# EAGLE design 9xVoice MikeB TH v101 (EAGLE 6.3)
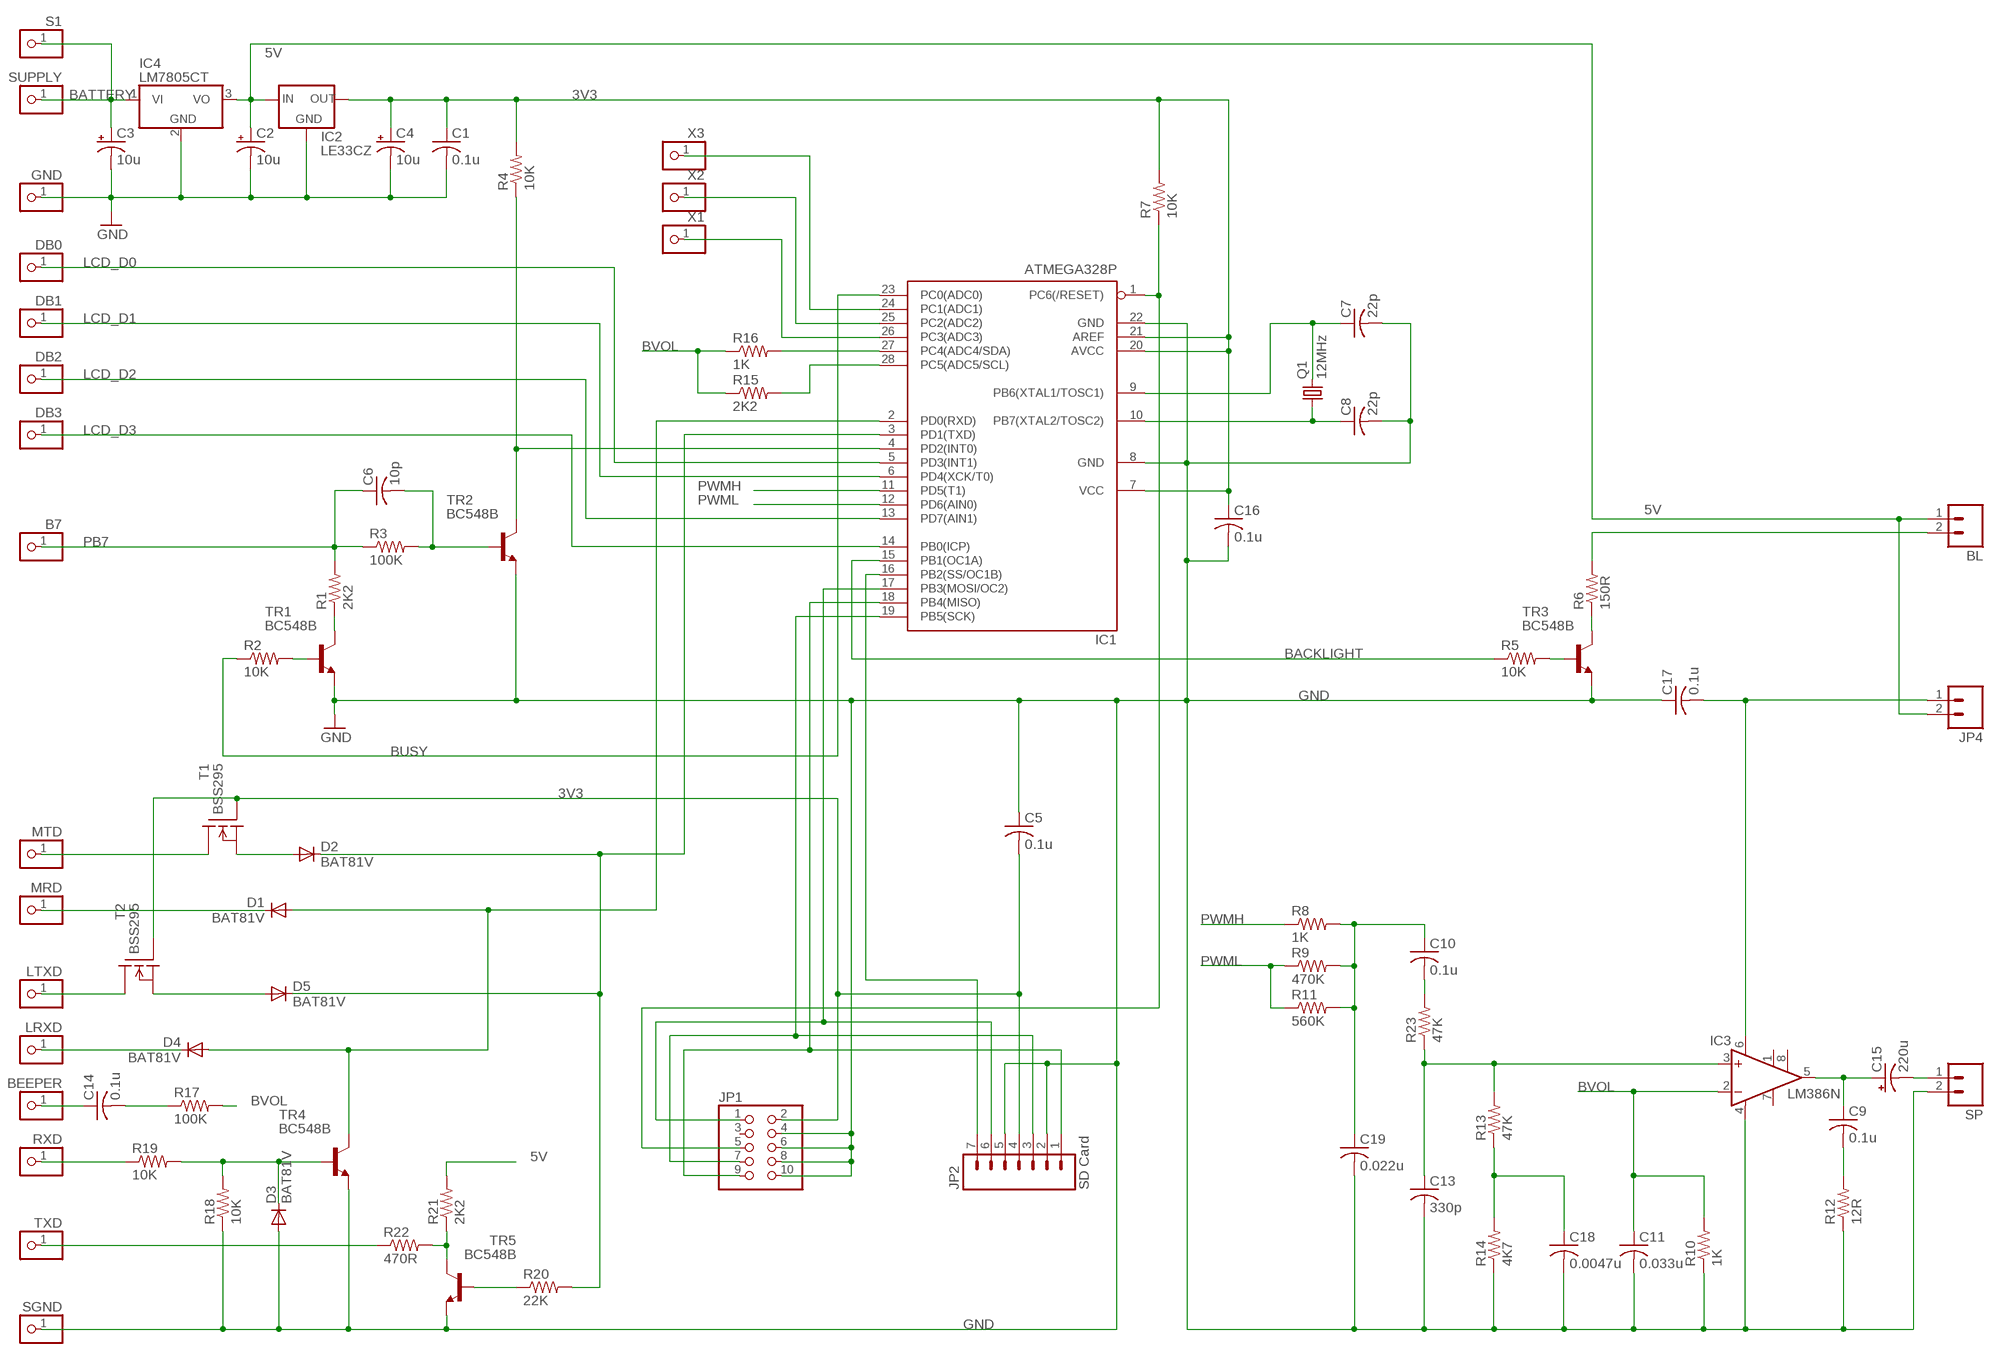
[diagram p0: schematic, sheet 1]

## Parts
B7  PINHD-1X1  [1X01]
BEEPER  PINHD-1X1  [1X01]
BL  M02PTH  [1X02]
C1  0.1u  C-US025-024X044  [C025-024X044]
C2  10u  CPOL-USE1.8-4  [E1,8-4]
C3  10u  CPOL-USE1.8-4  [E1,8-4]
C4  10u  CPOL-USE1.8-4  [E1,8-4]
C5  0.1u  C-US025-024X044  [C025-024X044]
C6  10p  C-US025-024X044  [C025-024X044]
C7  22p  C-US025-024X044  [C025-024X044]
C8  22p  C-US025-024X044  [C025-024X044]
C9  0.1u  C-US025-024X044  [C025-024X044]
C10  0.1u  C-US025-024X044  [C025-024X044]
C11  0.033u  C-US025-024X044  [C025-024X044]
C13  330p  C-US025-024X044  [C025-024X044]
C14  0.1u  C-US025-024X044  [C025-024X044]
C15  220u  CPOL-USE2.5-6  [E2,5-6]
C16  0.1u  C-US025-024X044  [C025-024X044]
C17  0.1u  C-US025-024X044  [C025-024X044]
C18  0.0047u  C-US025-024X044  [C025-024X044]
C19  0.022u  C-US025-024X044  [C025-024X044]
D1  BAT81V  DIODE-D-2.5  [D-2.5]
D2  BAT81V  DIODE-D-2.5  [D-2.5]
D3  BAT81V  DIODE-D-2.5  [D-2.5]
D4  BAT81V  DIODE-D-2.5  [D-2.5]
D5  BAT81V  DIODE-D-2.5  [D-2.5]
DB0  PINHD-1X1  [1X01]
DB1  PINHD-1X1  [1X01]
DB2  PINHD-1X1  [1X01]
DB3  PINHD-1X1  [1X01]
GND  PINHD-1X1  [1X01]
IC1  ATMEGA328P  MEGA8-P  [DIL28-3]
IC2  LE33CZ  78LXX  [78LXX]
IC3  LM386N  LM386N-1  [DIL08]
IC4  LM7805CT  7805T  [TO220H]
JP1  PINHD-2X5  [2X05]
JP2  SD Card  M07  [1X07]
JP4  M02PTH  [1X02]
LRXD  PINHD-1X1  [1X01]
LTXD  PINHD-1X1  [1X01]
MRD  PINHD-1X1  [1X01]
MTD  PINHD-1X1  [1X01]
Q1  12MHz  CRYSTALHC49US  [HC49US]
R1  2K2  R-US_0207/2V  [0207/2V]
R2  10K  R-US_0207/10  [0207/10]
R3  100K  R-US_0207/2V  [0207/2V]
R4  10K  R-US_0207/2V  [0207/2V]
R5  10K  R-US_0207/2V  [0207/2V]
R6  150R  R-US_0207/2V  [0207/2V]
R7  10K  R-US_0207/2V  [0207/2V]
R8  1K  R-US_0207/2V  [0207/2V]
R9  470K  R-US_0207/2V  [0207/2V]
R10  1K  R-US_0207/2V  [0207/2V]
R11  560K  R-US_0207/2V  [0207/2V]
R12  12R  R-US_0207/2V  [0207/2V]
R13  47K  R-US_0207/2V  [0207/2V]
R14  4K7  R-US_0207/2V  [0207/2V]
R15  2K2  R-US_0207/2V  [0207/2V]
R16  1K  R-US_0207/2V  [0207/2V]
R17  100K  R-US_0207/2V  [0207/2V]
R18  10K  R-US_0207/2V  [0207/2V]
R19  10K  R-US_0207/2V  [0207/2V]
R20  22K  R-US_0207/2V  [0207/2V]
R21  2K2  R-US_0207/2V  [0207/2V]
R22  470R  R-US_0207/2V  [0207/2V]
R23  47K  R-US_0207/2V  [0207/2V]
RXD  PINHD-1X1  [1X01]
S1  PINHD-1X1  [1X01]
SGND  PINHD-1X1  [1X01]
SP  M02PTH  [1X02]
SUPPLY  PINHD-1X1  [1X01]
T1  BSS295  [TO92]
T2  BSS295  [TO92]
TR1  BC548B  [TO92-EBC]
TR2  BC548B  [TO92-EBC]
TR3  BC548B  [TO92-EBC]
TR4  BC548B  [TO92-EBC]
TR5  BC548B  [TO92-EBC]
TXD  PINHD-1X1  [1X01]
X1  PINHD-1X1  [1X01]
X2  PINHD-1X1  [1X01]
X3  PINHD-1X1  [1X01]

## Nets
3V3: C1.1 C4.+ C5.2 C16.1 IC1.7(VCC) IC1.20(AVCC) IC1.21(AREF) IC2.OUT JP1.2 JP2.4 R4.2 R7.2 T1.1(G) T2.1(G)
5V: BL.1 C2.+ IC2.IN IC4.3(VO) JP4.2 R21.2
BACKLIGHT: IC1.15(PB1(OC1A)) R5.1
BATTERY: C3.+ IC4.1(VI) S1.1 SUPPLY.1
BUSY: IC1.23(PC0(ADC0)) R2.1
BVOL: C11.1 IC3.2(-IN) R10.2 R15.1 R16.1 R17.2
GND: C1.2 C2.- C3.- C4.- C5.1 C7.2 C8.2 C11.2 C13.2 C16.2 C17.1 C18.2 C19.2 D3.A GND.1 IC1.8(GND) IC1.22(GND) IC2.GND IC3.4(GND) IC4.2(GND) JP1.4 JP1.6 JP1.8 JP1.10 JP2.2 JP2.5 R10.1 R12.1 R14.1 R18.1 SGND.1 SP.2 TR1.E TR2.E TR3.E TR4.E TR5.E
LCD_D0: DB0.1 IC1.5(PD3(INT1))
LCD_D1: DB1.1 IC1.6(PD4(XCK/T0))
LCD_D2: DB2.1 IC1.13(PD7(AIN1))
LCD_D3: DB3.1 IC1.14(PB0(ICP))
MISO: IC1.18(PB4(MISO)) JP1.9 JP2.1
MOSI: IC1.17(PB3(MOSI/OC2)) JP1.1 JP2.6
N$2: R21.1 R22.2 TR5.C
N$3: R22.1 TXD.1
N$4: R20.1 TR5.B
N$5: IC1.28(PC5(ADC5/SCL)) R15.2
N$6: IC1.27(PC4(ADC4/SDA)) R16.2
N$7: IC1.26(PC3(ADC3)) X1.1
N$8: IC1.25(PC2(ADC2)) X2.1
N$9: IC1.24(PC1(ADC1)) X3.1
N$10: R19.1 RXD.1
N$11: D3.C R18.2 R19.2 TR4.B
N$12: D4.C LRXD.1
N$14: D5.A T2.3(S)
N$15: D2.A T1.3(S)
N$16: MTD.1 T1.2(D)
N$17: LTXD.1 T2.2(D)
N$18: D1.C MRD.1
N$21: R1.1 TR1.C
N$22: R2.2 TR1.B
N$23: C6.2 R3.2 TR2.B
N$24: BEEPER.1 C14.1
N$25: C14.2 R17.1
N$26: R5.2 TR3.B
N$27: R6.1 TR3.C
N$28: C10.2 R23.2
N$29: IC1.4(PD2(INT0)) R4.1 TR2.C
N$30: C8.1 IC1.10(PB7(XTAL2/TOSC2)) Q1.1
N$31: C7.1 IC1.9(PB6(XTAL1/TOSC1)) Q1.2
N$33: BL.2 R6.2
N$34: C9.1 C15.+ IC3.5(OUT)
N$35: C9.2 R12.2
N$36: C15.- SP.1
N$37: C17.2 IC3.6(VS) JP4.1
N$38: C13.1 IC3.3(+IN) R13.2 R23.1
N$39: C10.1 C19.1 R8.2 R9.2 R11.2
N$40: C18.1 R13.1 R14.2
PB7: B7.1 C6.1 R1.2 R3.1
PWMH: IC1.11(PD5(T1)) R8.1
PWML: IC1.12(PD6(AIN0)) R9.1 R11.1
RESET: IC1.1(PC6(/RESET)) JP1.5 R7.1
RXD: D1.A D4.A IC1.2(PD0(RXD)) TR4.C
SCK: IC1.19(PB5(SCK)) JP1.7 JP2.3
SS: IC1.16(PB2(SS/OC1B)) JP2.7
TXD: D2.C D5.C IC1.3(PD1(TXD)) R20.2
Unconnected: IC3.1(GAIN) IC3.7(BYPASS) IC3.8(GAIN) JP1.3

## Library data of the parts
B7 BEEPER DB0 DB1-DB3 GND LRXD LTXD MRD MTD RXD S1 SGND SUPPLY TXD X1-X3 = pinhead:PINHD-1X1: PIN HEADER
BL JP4 SP = SparkFun-Connectors:M02: Header 2 Standard 2-pin 0.1" header. Use with straight break away headers (SKU : PRT-00116), right angle break away headers (PRT-00553), swiss pins (PRT-00743), machine pins (PRT-00117), and female headers (PRT-00115). Molex polarized connector foot print use with SKU : PRT-08233 with associated crimp pins and housings.
C1 C5-C11 C13 C14 C16-C19 = rcl:C-US: CAPACITOR, American symbol
C2-C4 C15 = rcl:CPOL-US: POLARIZED CAPACITOR, American symbol
D1-D5 = diode:DIODE-: DIODE
IC1 = atmel:MEGA8-P: MICROCONTROLLER 8 Kbytes FLASH, 1 kbytes SRAM, 512 bytes EEPROM, USART, 4-channel 10 bit ADC, 2-channel 8 bit ADC Pin compatible with Atmega48, ATMega88, ATMega168 Source: avr.lbr; OC_FARNELL: unknown; OC_NEWARK: unknown
IC2 = v-reg:78LXX: VOLTAGE REGULATOR
IC3 = linear:LM386?-*: Low Voltage Audio Power Amplifier Source: http://cache.national.com/ds/LM/LM386.pdf
IC4 = linear:78*: Positive VOLTAGE REGULATOR Source: http://cache.national.com/ds/LM/LM78L05.pdf http://www.fairchildsemi.com/ds/LM/LM7805.pdf
JP1 = pinhead:PINHD-2X5: PIN HEADER
JP2 = SparkFun-Connectors:M07: Header 7 Standard 7-pin 0.1" header. Use with straight break away headers (SKU : PRT-00116), right angle break away headers (PRT-00553), swiss pins (PRT-00743), machine pins (PRT-00117), and female headers (PRT-00115). NOTES ON THE VARIANTS LOCK and LOCK_LONGPADS... This footprint was designed to help hold the alignment of a through-hole component (i.e. 7-pin header) while soldering it into place. You may notice that each hole has been shifted either up or down by 0.005 of an inch from it's more standard position (which is usually a perfectly straight line). This slight alteration caused the pins (the squares in the middle) to touch the edges of the holes. Because they are alternating, it causes a "brace" to hold the header in place. 0.005 has proven to be the perfect amount of "off-center" position when using our standard breakaway headers. Although looks a little odd when you look at the bare footprint, once you have a header in there, the alteration is very hard to notice. Also, if you push a header all the way into place, it is covered up entirely on the bottom side. This idea of altering the position of holes to aid alignment will be further integrated into the Sparkfun Library for other footprints. It can help hold any component with 3 or more connection pins.
Q1 = SparkFun-FreqCtrl:CRYSTAL: Various standard crystals. Proven footprints. Spark Fun Electronics SKU : COM-00534
R1-R23 = rcl:R-US_: RESISTOR, American symbol
T1 T2 = transistor-fet:BSS295: N-Channel Enhancement MOSFET not checked
TR1-TR5 = transistor-npn:BC548*: NPN Transistor

## Board
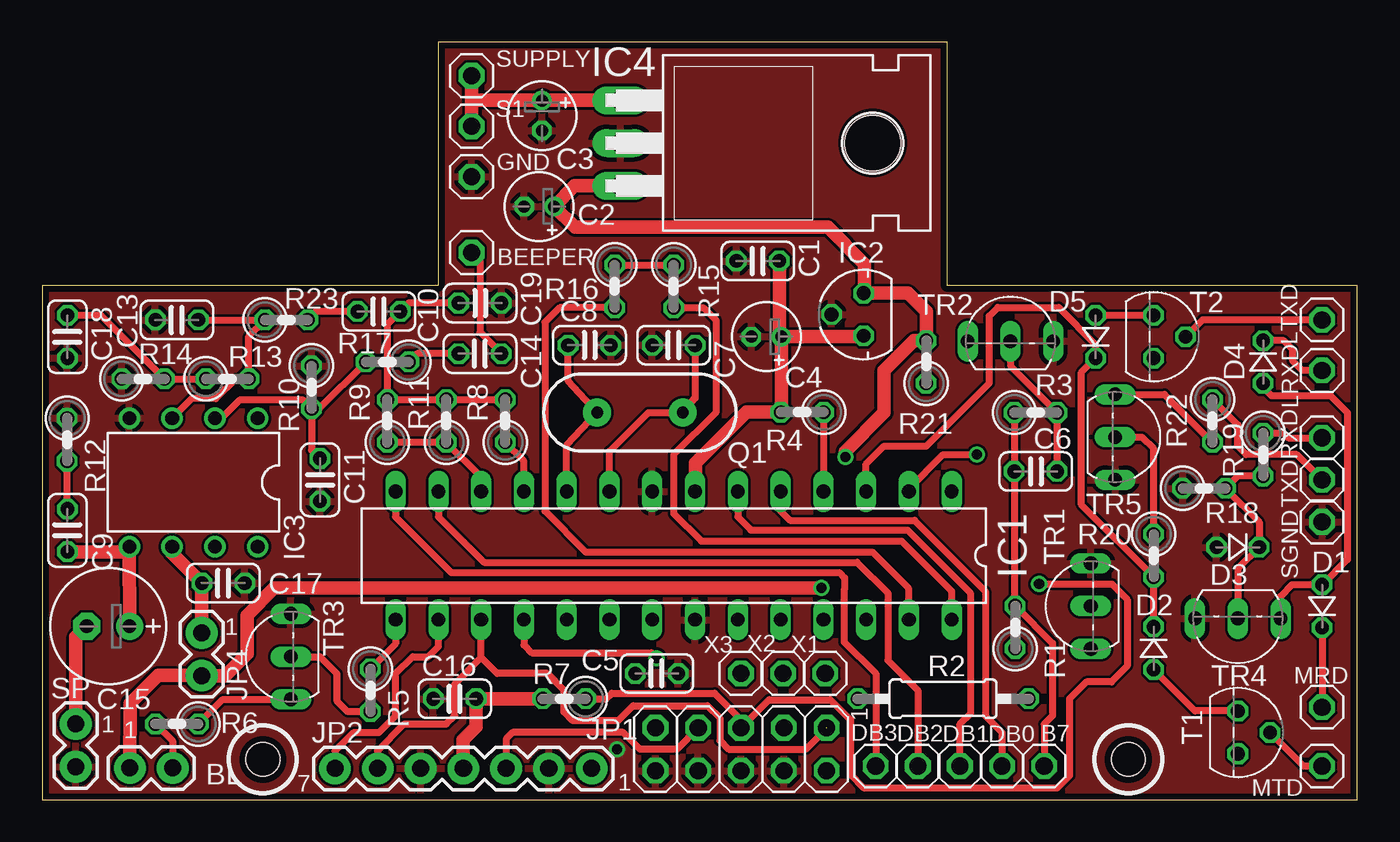
[diagram p1: board, top side]
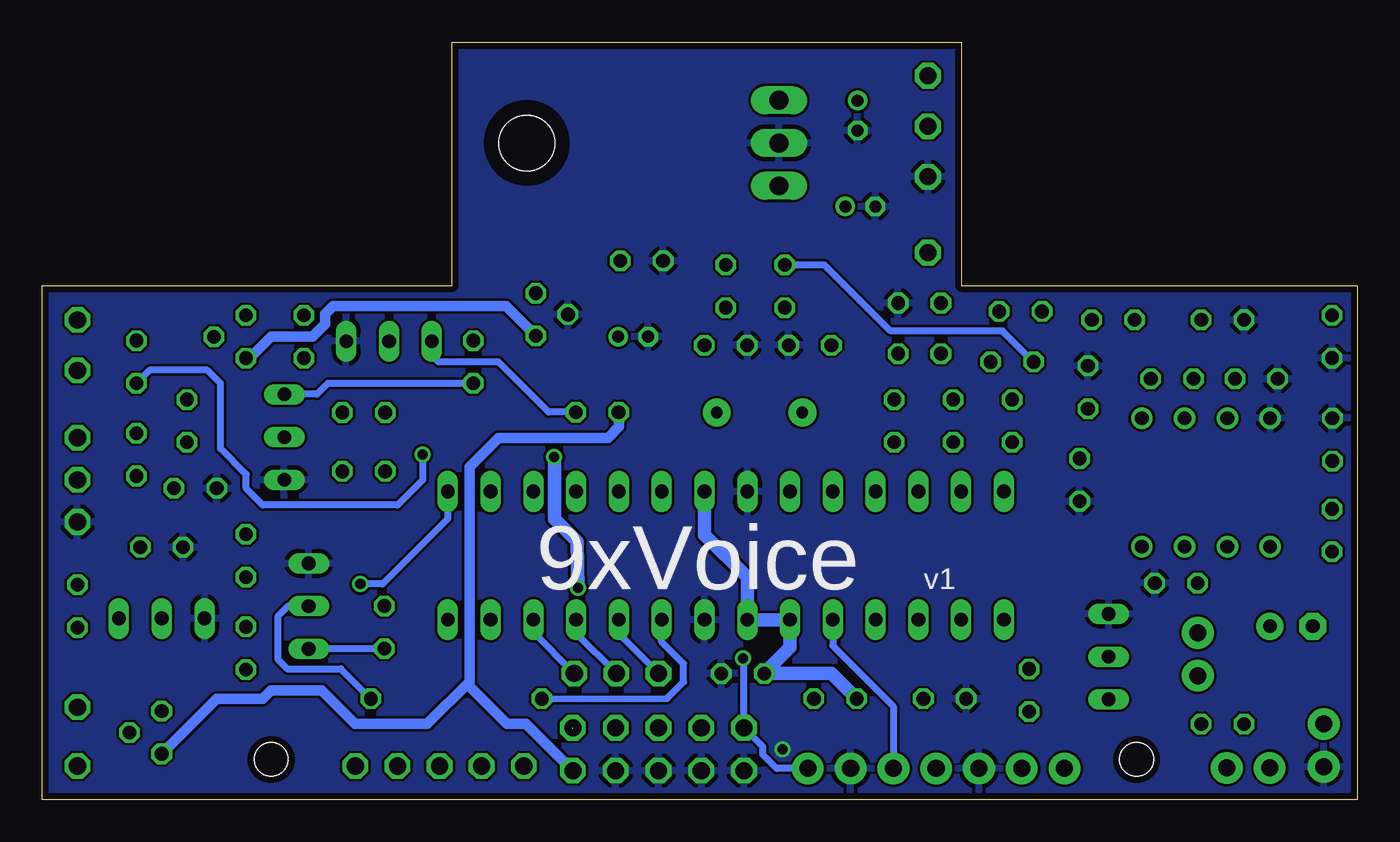
[diagram p2: board, bottom side, seen from below]

Size 78.1 x 45 mm. Coordinates in mm from the lower left corner, seen from the top.
Outline: 0,0 78.1,0 78.1,30.55 53.75,30.55 53.75,45 23.5,45 23.5,30.55 0,30.55 0,0
Copper layers (1*16): Top 0.0356mm / dielectric 1.5011mm / Bottom 0.0356mm
Design rules "LaenPCBOrder *": minimum track width 6mil, minimum drill 13mil, track to track 6mil, track to pad 6mil, pad to pad 6mil, via to via 6mil, smd to smd 6mil, copper to edge 15mil, drill to drill 6mil, minimum pad ring 7mil, minimum via ring 7mil, stop-mask expansion 4mil, vias tented up to drill 24mil, thermal gap 10mil
Holes 2 mm at 13.1,2.4 64.5,2.4

### Footprints (pad centres in the part's own frame; a part is rotated, then mirrored left to right if it is on the bottom)
1X01 = drill 1.016 octagon: 1 0,0
1X02 = drill 1.016 pad 1.88: 1 0,0; 2 2.54,0
C025-024X044 = drill 0.813 octagon: 1 -1.27,0; 2 1.27,0
E1,8-4 = drill 0.711 pad 1.168: + -0.889,0 | drill 0.711 pad 1.168 octagon: - 0.889,0
E2,5-7 = drill 0.813 pad 1.6: + -1.27,0 | drill 0.813 pad 1.6 octagon: - 1.27,0
D-2.5 = drill 0.813 octagon: A 1.27,0; C -1.27,0
DIL28-3 = drill 0.813 long: 1 -16.51,-3.81; 2 -13.97,-3.81; 3 -11.43,-3.81; 4 -8.89,-3.81; 5 -6.35,-3.81; 6 -3.81,-3.81; 7 -1.27,-3.81; 8 1.27,-3.81; 9 3.81,-3.81; 10 6.35,-3.81; 11 8.89,-3.81; 12 11.43,-3.81; 13 13.97,-3.81; 14 16.51,-3.81; 15 16.51,3.81; 16 13.97,3.81; 17 11.43,3.81; 18 8.89,3.81; 19 6.35,3.81; 20 3.81,3.81; 21 1.27,3.81; 22 -1.27,3.81; 23 -3.81,3.81; 24 -6.35,3.81; 25 -8.89,3.81; 26 -11.43,3.81; 27 -13.97,3.81; 28 -16.51,3.81
78LXX = drill 0.813 octagon: GND 0,1.905; IN 1.27,0; OUT -1.27,0
DIL08 = drill 0.813 pad 1.27: 1 -3.81,-3.81; 2 -1.27,-3.81; 3 1.27,-3.81; 4 3.81,-3.81; 5 3.81,3.81; 6 1.27,3.81; 7 -1.27,3.81; 8 -3.81,3.81
TO220H = drill 1.118 long: 1 -2.54,-10.16; 2 0,-10.16; 3 2.54,-10.16 | hole 3.302: 0,4.826
2X05 = drill 1.016 octagon: 1 -5.08,-1.27; 2 -5.08,1.27; 3 -2.54,-1.27; 4 -2.54,1.27; 5 0,-1.27; 6 0,1.27; 7 2.54,-1.27; 8 2.54,1.27; 9 5.08,-1.27; 10 5.08,1.27
1X07 = drill 1.016 pad 1.88: 1 0,0; 2 2.54,0; 3 5.08,0; 4 7.62,0; 5 10.16,0; 6 12.7,0; 7 15.24,0
HC49US = drill 0.7 pad 1.651: 1 -2.54,0; 2 2.54,0
0207/2V = drill 0.813 octagon: 1 -1.27,0; 2 1.27,0
0207/10 = drill 0.813 octagon: 1 -5.08,0; 2 5.08,0
TO92 = drill 0.813 octagon: 1 1.27,0; 2 0,1.905; 3 -1.27,0
TO92-EBC = drill 0.813 long: B 0,-1.27; C -2.54,-1.27; E 2.54,-1.27

### Placement (x,y rotation side)
B7  59.5,2 0 top
BEEPER  25.5,32.5 0 top
BL  5.21,1.89 0 top
C1  42.5,32 180 top
C2  29.52,35.24 180 top
C3  29.68,40.64 270 top
C4  43,27.5 180 top
C5  36.5,7.5 180 top
C6  59,19.5 0 top
C7  37.5,27 180 top
C8  32.5,27 0 top
C9  1.5,16 90 top
C10  20,29 180 top
C11  16.5,19 270 top
C13  8,28.5 180 top
C14  26,26.5 180 top
C15  220u  [E2,5-7]  3.92,10.31 180 top
C16  24.5,6 180 top
C17  10.76,12.87 180 top
C18  1.5,27.5 270 top
C19  26,29.5 0 top
D1  76,11.5 90 top
D2  66,9 270 top
D3  71,15 180 top
D4  72.5,26 270 top
D5  62.55,27.5 90 top
DB0  57,2 0 top
DB1  54.5,2 0 top
DB2  52,2 0 top
DB3  49.5,2 0 top
GND  25.5,37 0 top
IC1  37.5,14.5 180 top
IC2  48.78,28.82 90 top
IC3  8.99,18.85 180 top
IC4  44.5,39 270 top
JP1  41.5,3 180 top
JP2  32.63,1.86 180 top
JP4  9.48,9.91 270 top
LRXD  76,25.5 0 top
LTXD  76,28.5 0 top
MRD  76,5.5 0 top
MTD  76,2 0 top
Q1  35.5,23 0 top
R1  57.78,10.24 90 top
R2  53.5,6 0 top
R3  59,23 0 top
R4  45.14,23.02 180 top
R5  19.5,6.5 270 top
R6  8,4.5 180 top
R7  31,6 180 top
R8  27.5,22.5 90 top
R9  20.5,22.5 90 top
R10  16,24.5 270 top
R11  24,22.5 90 top
R12  1.49,21.39 270 top
R13  11,25 0 top
R14  6,25 0 top
R15  37.5,30.5 270 top
R16  34,30.5 270 top
R17  20.5,26 180 top
R18  69,18.5 0 top
R19  72.5,20.5 270 top
R20  66,14.5 270 top
R21  52.5,26 90 top
R22  69.5,22.5 270 top
R23  14.5,28.5 0 top
RXD  76,21.5 0 top
S1  25.5,40 0 top
SGND  76,16.5 0 top
SP  2,4.5 270 top
SUPPLY  25.5,43 0 top
T1  71,4 270 top
T2  66,27.5 270 top
TR1  61,11.5 90 top
TR2  57.5,28.5 0 top
TR3  13.5,8.5 90 top
TR4  71,9.5 180 top
TR5  64.99,21.54 270 top
TXD  76,19 0 top
X1  46.5,7.5 0 top
X2  44,7.5 0 top
X3  41.5,7.5 0 top

### Tracks (layer width: path | path; a pad name or v marks a point on that pad's centre or on a via)
3V3
  Top 0.813: C1.1 43.77,27.62 C4.+ | C4.+ 48.73,27.5 IC2.OUT | C4.+ 43.89,23.04 R4.2 41.83,23.02 38.8,19.99 38.8,18.34 IC1.7 | R7.2 C16.1 25.77,4.34 25,3.57 25.01,3.57 JP2.4
  Bottom 0.406: 52.73,6.73 52.73,7 | 43.84,22.99 R4.2
  Bottom 0.61: 43.84,22.99 43.84,22.16 44.5,21.5 51,21.5 52.73,19.77 52.73,7 55.23,4.5 59.5,4.5 61.5,6.5 64.5,6.5 65,6 67.73,6 T1.1 | T2.1 65.77,26.23 64.5,27.5 62.03,27.5 61.28,28.25 61.28,28.85 60.82,29.31 50.54,29.31 IC2.OUT | JP1.2 49.35,4.5 50.5,4.5 52.73,6.73
  Bottom 0.813: IC1.7 38.77,15.74 36.23,13.2 IC1.21 IC1.20 33.69,9.04 C5.2 31.23,7.5 R7.2
5V  (via drill 0.6)
  Top 0.813: IC4.3 31.63,36.46 C2.+ 31.65,34 46.65,34 48.83,31.82 48.83,30.14 IC2.IN 51.41,30.09 52.5,29 R21.2 51.77,27.27 50,25.5 50,23 47.69,20.69 v47.69,20.35 | BL.1 5.23,5.73 6.88,7.38 JP4.2 10.87,7.37 12.17,8.67 12.17,10.96 13.79,12.58 v46.28,12.58
  Bottom 0.813: v46.28,12.58 46.33,15.33 47.68,16.68 v47.68,20.34 v47.69,20.35
BACKLIGHT
  Top 0.406: IC1.15 20.99,9.26 R5.1
BATTERY
  Top 0.813: S1.1 SUPPLY.1 25.5,41.54 C3.+ | C3.+ | C3.+ IC4.1
BUSY
  Bottom 0.406: R2.1 40.98,6.02 40,7 40,8.08 41.31,9.39 IC1.23
BVOL
  Top 0.406: R16.1 R15.1 | R10.2 16.46,23.23 R17.2 | R10.2 16,20.77 C11.1 | IC3.2 10.66,22.66 11.77,23.77 15.46,23.77 R10.2
  Bottom 0.406: R17.2 21.07,27.84 27.72,27.84 31.65,31.77 R16.1
GND  (via drill 0.6)
  other vias: 34.14,3
  pour Top: 0,0 0,30.56 23.5,30.56 23.5,44.99 53.74,44.99 53.74,30.56 78.09,30.56 78.09,0
  pour Bottom: 0,0 0,30.56 23.5,30.56 23.54,30.56 23.54,44.98 53.74,44.98 53.74,44.99 53.77,44.99 53.77,30.56 78.09,30.56 78.09,0
LCD_D0
  Top 0.406: IC1.5 43.85,17.15 44.41,16.59 51.8,16.59 56,12.39 56,5 57,4 DB0.1
LCD_D1
  Top 0.406: IC1.6 41.31,16.8 42.09,16.02 51.39,16.02 55.11,12.3 55.11,5.11 54.5,4.5 DB1.1
LCD_D2
  Top 0.406: IC1.13 23.53,16.81 26.23,14.11 48.39,14.11 50.21,12.29 50.21,8.29 52,6.5 DB2.1
LCD_D3
  Top 0.406: IC1.14 20.99,16.8 24.29,13.5 47.34,13.5 47.65,13.19 47.65,12.5 47.64,12.49 47.64,9.36 49.5,7.5 DB3.1
MISO  (via drill 0.6)
  Top 0.406: IC1.18 28.61,9.19 29.07,8.73 36.17,8.73 v36.49,8.41
  Bottom 0.406: JP2.1 34.49,1.86 35.31,2.68 35.31,3.16 JP1.9 36.42,8.34 v36.49,8.41
MOSI  (1 unrouted)
  Top 0.406: 26.08,8.45 24.5,6.87 24.5,5 24,4.5 21.5,4.5 19.92,2.92 19.93,2.92 JP2.6 | 26.08,8.45 IC1.17 | 26.08,8.45 27.03,7.5 30,7.5 30.99,6.51 30.99,5.22 31.51,4.7 34.2,4.7 35.09,5.59 39.51,5.59 40.24,4.86 40.24,3.53 40.76,3.01 45.35,3.01 46.59,4.25
N$2
  Top 0.406: TR5.C 66.65,24.08 R22.2
  Bottom 0.406: R21.1 61.14,24.73 61.78,24.09 TR5.C
N$3
  Top 0.406: TXD.1 74.5,20.5 71.5,20.5 71,21 71,22.27 R22.1
N$4
  Top 0.406: R20.1 66,20.85 65.32,21.53 TR5.B
N$5
  Top 0.406: R15.2 39.27,29.23 40,28.5 40,23 37.5,20.5 37.5,17 39.14,15.36 51.04,15.36 54.01,12.39 IC1.28
N$6
  Top 0.406: R16.2 30.73,29.23 29.86,28.36 29.86,17.14 32.28,14.72 49.3,14.72 51.47,12.55 IC1.27
N$7
  Bottom 0.406: X1.1 48.93,9.93 IC1.26
N$8
  Bottom 0.406: X2.1 46.39,9.89 IC1.25
N$9
  Bottom 0.406: X3.1 43.85,9.85 IC1.24
N$10
  Top 0.406: R19.1 73.73,21.77 74,21.5 RXD.1
N$11
  Top 0.406: R19.2 71,19.23 R18.2 72.27,16.5 D3.C 71,13.73 TR4.B
N$12
  Top 0.406: LRXD.1 74.82,25.5 74.26,26.06 74.26,26.74 73.73,27.27 D4.C
N$14
  Top 0.406: T2.3 D5.A
N$15
  Top 0.406: T1.3 68.46,5.27 D2.A
N$16
  Top 0.406: MTD.1 74.91,2 T1.2
N$17
  Top 0.406: LTXD.1 68.91,28.5 T2.2
N$18
  Top 0.406: D1.C MRD.1
N$21
  Bottom 0.406: R1.1 TR1.C
N$22
  Bottom 0.406: TR1.B 63.5,11.5 64.11,10.89 64.11,8.34 63.56,7.79 60.37,7.79 R2.2
N$23
  Top 0.406: C6.2 R3.2 57.5,25.77 TR2.B
N$24
  Top 0.406: BEEPER.1 26,32 26,27.77 C14.1
N$25
  Top 0.406: C14.2 22.27,26.5 R17.1
N$26
  Top 0.406: TR3.B 16.5,8.5 17.5,7.5 17.5,5.88 18.15,5.23 R5.2
N$27
  Top 0.406: R6.1 10.73,5.96 TR3.C
N$28
  Top 0.406: C10.2 16.27,29 R23.2
N$29
  Top 0.406: R4.1 46.41,18.33 IC1.4
  Bottom 0.406: R4.1 48.02,23.02 51,26 54.57,26 54.96,26.39 TR2.C
N$30
  Top 0.406: IC1.10 31.15,21.06 Q1.1 31.23,24.86 C8.1
N$31
  Top 0.406: IC1.9 33.69,20.69 36,23 Q1.2 38.77,23.86 C7.1
N$33
  Top 0.406: BL.2 7.77,3.46 R6.2
N$34
  Top 0.813: C9.1 5.15,14.73 IC3.5 C15.+
N$35
  Top 0.406: C9.2 R12.2
N$36
  Top 0.813: SP.1 2,9.66 C15.-
N$37
  Top 0.813: JP4.1 C17.2 7.72,14.64 IC3.6
N$38
  Top 0.406: C13.1 R23.1 12.27,27.54 R13.2 11.5,25 10.32,23.82 8.88,23.82 IC3.3
N$39
  Top 0.406: C19.1 21.77,29.5 C10.1 20.5,28.23 R9.2 R11.2 R8.2
N$40
  Top 0.406: R13.1 R14.2 3.5,28.77 C18.1
PB7
  Top 0.406: R3.1 C6.1 57.73,11.56 R1.2 60,9.29 60,5 59.5,4.5 B7.1
PWMH
  Top 0.406: IC1.11 28.61,20.12 R8.1
PWML
  Top 0.406: IC1.12 26.07,19.16 R11.1 R9.1
RESET  (via drill 0.6)
  Top 0.406: R7.1 33.5,6 33.83,6.33 39.93,6.33 41.5,4.76 JP1.5 43.17,5.94 46.81,5.94 48,4.75 48,1.5 48.81,0.69 60.26,0.69 61,1.43 61,6 62,7 63.5,7 64.44,7.94 64.44,11.89 63.52,12.81 v59.2,12.81
  Bottom 0.406: IC1.1 54.01,16.69 57.89,12.81 v59.2,12.81
RXD  (via drill 0.6)
  Top 0.406: D4.A 72.5,24.5 73,24 76.5,24 77.5,23 77.5,14.27 D1.A 74.23,12.78 73.54,12.09 TR4.C | IC1.2 51.47,18.47 53.5,20.5 v55.5,20.5
  Bottom 0.406: v55.5,20.5 55.5,19 57,17.5 65,17.5 65.98,18.48 65.98,19.33 67.5,20.85 67.5,24.73 68.29,25.52 71.71,25.52 D4.A
SCK
  Top 0.406: JP1.7 37.69,3 35.5,3 34.5,4 27.93,4 27.55,3.62 JP2.3
  Bottom 0.406: IC1.19 31.15,9.15 27.55,5.55 JP2.3
SS
  Top 0.406: IC1.16 23.53,9.1 22.93,8.5 22,8.5 21,7.5 21,5 20,4 18.5,4 17.38,2.88 17.39,2.88 JP2.7
TXD
  Top 0.406: D2.C R20.2 61.71,17.52 61.71,25.39 D5.C 62.55,27.05 60.36,29.24 56.74,29.24 56.24,28.74 56.24,24.74 52.5,21 50,21 48.93,19.93 IC1.3

### Text on the board
tNames: 1 | 1 | 1 | 1 | 1 | 7
bNames: v1 | 9xVoice